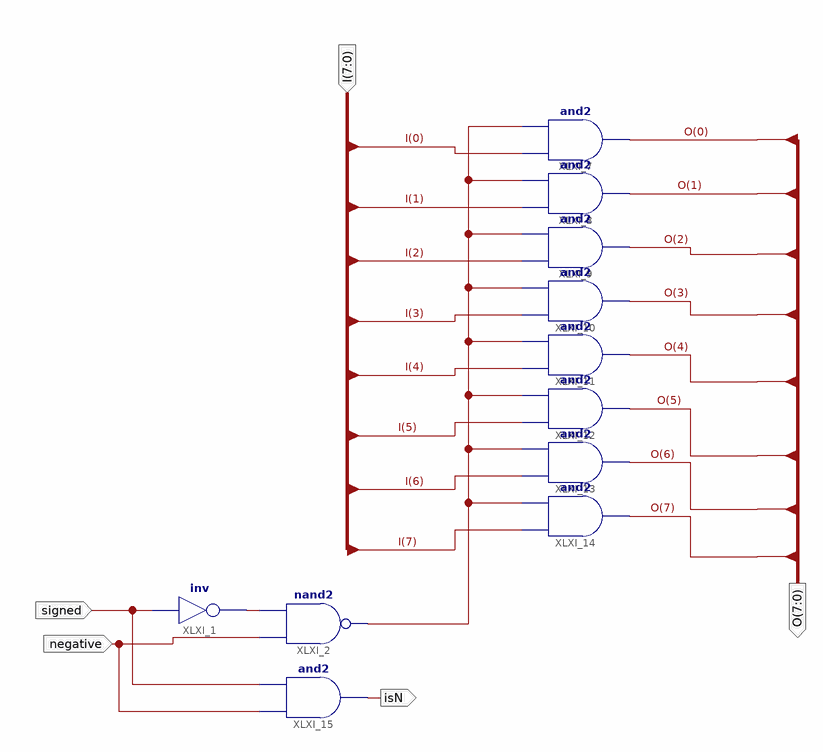
[diagram p0: schematic sheet 1]
// Xilinx ISE schematic toZero.sch (spartan3e) as structural Verilog: 11 symbols, 5 ports
module toZero (
  input  \signed ,
  input  negative,
  input  [7:0] I,
  output [7:0] O,
  output isN
);

  wire XLXN_6, XLXN_24;

  not XLXI_1 (XLXN_6, \signed );
  nand XLXI_2 (XLXN_24, negative, XLXN_6);
  and XLXI_7 (O[0], I[0], XLXN_24);
  and XLXI_8 (O[1], I[1], XLXN_24);
  and XLXI_9 (O[2], I[2], XLXN_24);
  and XLXI_10 (O[3], I[3], XLXN_24);
  and XLXI_11 (O[4], I[4], XLXN_24);
  and XLXI_12 (O[5], I[5], XLXN_24);
  and XLXI_13 (O[6], I[6], XLXN_24);
  and XLXI_14 (O[7], I[7], XLXN_24);
  and XLXI_15 (isN, negative, \signed );
endmodule
